# Altium schematic sheet EndStops.SchDoc: Endstops
size Letter; DocumentNumber: 6; SheetNumber: 6; SheetTotal: 11
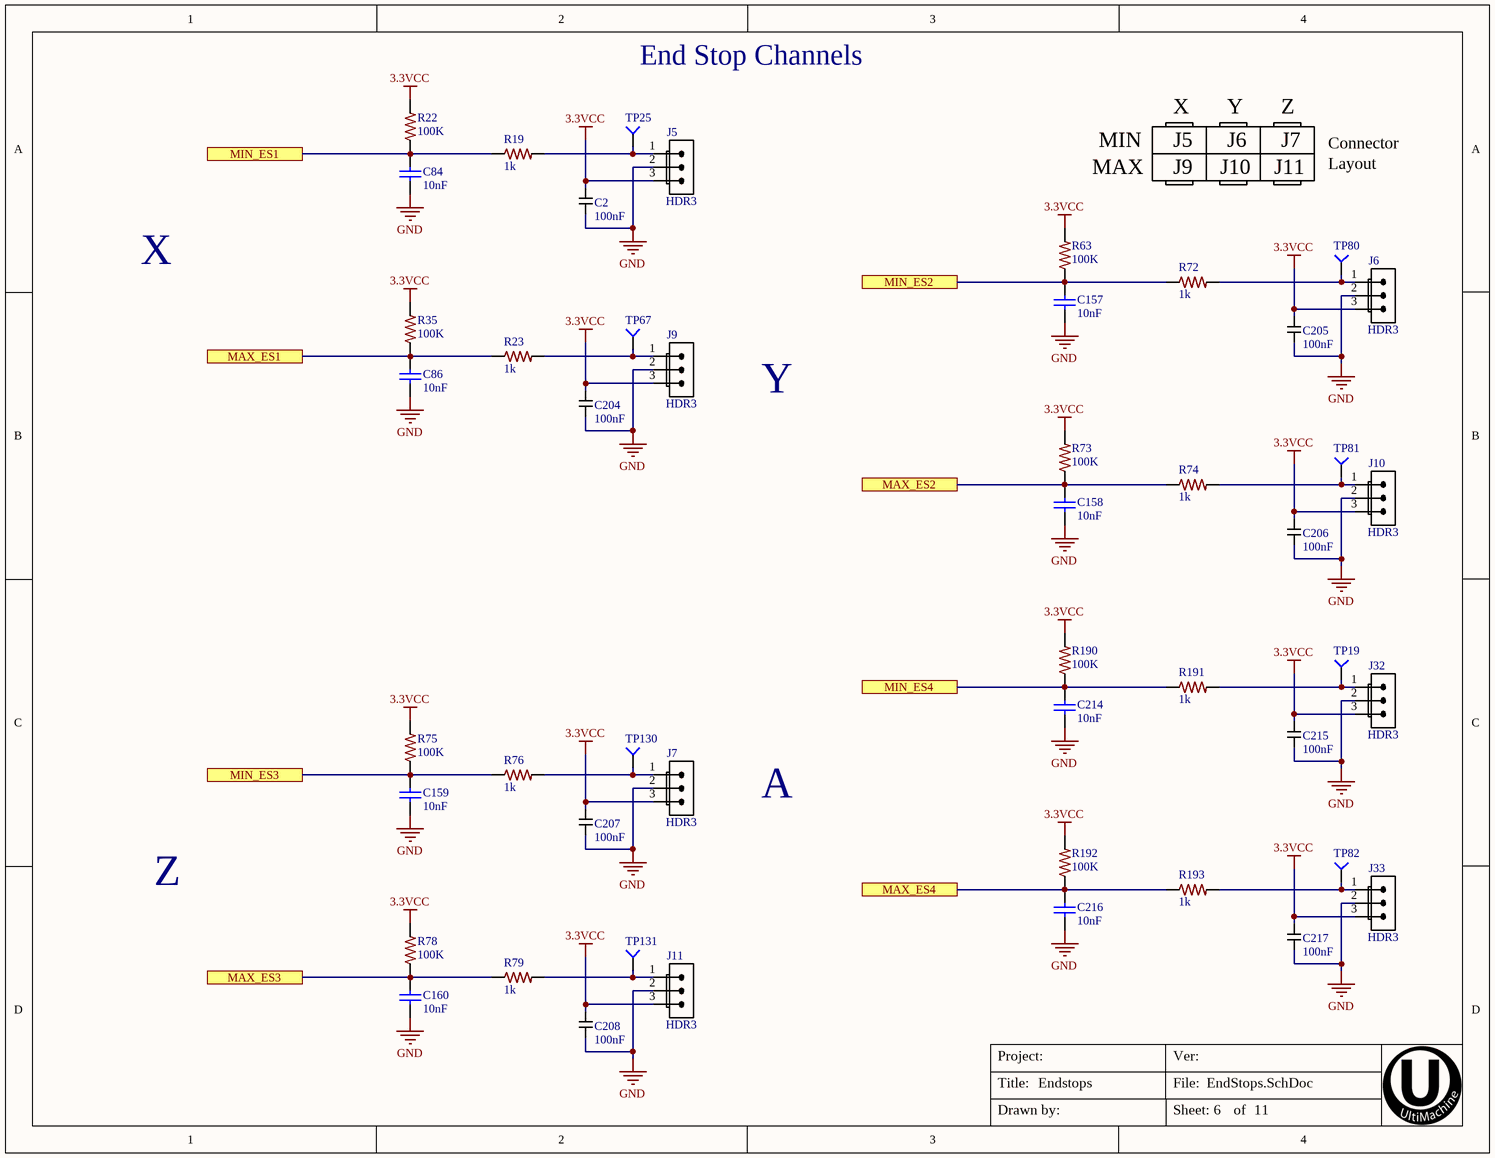
[diagram p0: EndStops.SchDoc]

## Parts
C2  100nF  [C0201 Large Pads]
C84  10nF  [C0402]
C86  10nF  [C0402]
C157  10nF  [C0402]
C158  10nF  [C0402]
C159  10nF  [C0402]
C160  10nF  [C0402]
C204  100nF  [C0201 Large Pads]
C205  100nF  [C0201 Large Pads]
C206  100nF  [C0201 Large Pads]
C207  100nF  [C0201 Large Pads]
C208  100nF  [C0201 Large Pads]
C214  10nF  [C0402]
C215  100nF  [C0201 Large Pads]
C216  10nF  [C0402]
C217  100nF  [C0201 Large Pads]
J5  value HDR3  [70543-02 PIN-IN-PASTE]  (hidden comment: Molex 70543-03)
J6  value HDR3  [70543-02 PIN-IN-PASTE]  (hidden comment: Molex 70543-03)
J7  value HDR3  [70543-02 PIN-IN-PASTE]  (hidden comment: Molex 70543-03)
J9  value HDR3  [70543-02 PIN-IN-PASTE]  (hidden comment: Molex 70543-03)
J10  value HDR3  [70543-02 PIN-IN-PASTE]  (hidden comment: Molex 70543-03)
J11  value HDR3  [70543-02 PIN-IN-PASTE]  (hidden comment: Molex 70543-03)
J32  value HDR3  [70543-02 PIN-IN-PASTE]  (hidden comment: Molex 70543-03)
J33  value HDR3  [70543-02 PIN-IN-PASTE]  (hidden comment: Molex 70543-03)
R19  1k  [R0402]
R22  100K  [R0402]
R23  1k  [R0402]
R35  100K  [R0402]
R63  100K  [R0402]
R72  1k  [R0402]
R73  100K  [R0402]
R74  1k  [R0402]
R75  100K  [R0402]
R76  1k  [R0402]
R78  100K  [R0402]
R79  1k  [R0402]
R190  100K  [R0402]
R191  1k  [R0402]
R192  100K  [R0402]
R193  1k  [R0402]
TP19  TP4  [TP-2]  (value not drawn)  (no BOM)
TP25  TP4  [TP-2]  (value not drawn)  (no BOM)
TP67  TP4  [TP-2]  (value not drawn)  (no BOM)
TP80  TP4  [TP-2]  (value not drawn)  (no BOM)
TP81  TP4  [TP-2]  (value not drawn)  (no BOM)
TP82  TP4  [TP-2]  (value not drawn)  (no BOM)
TP130  TP4  [TP-2]  (value not drawn)  (no BOM)
TP131  TP4  [TP-2]  (value not drawn)  (no BOM)

## Ports
MAX_ES1, MAX_ES2, MAX_ES3, MAX_ES4, MIN_ES1, MIN_ES2, MIN_ES3, MIN_ES4

## Nets
3.3VCC: C2.2 C204.2 C205.2 C206.2 C207.2 C208.2 C215.2 C217.2 J5.3(S) J6.3(S) J7.3(S) J9.3(S) J10.3(S) J11.3(S) J32.3(S) J33.3(S) R22.2 R35.2 R63.2 R73.2 R75.2 R78.2 R190.2 R192.2
GND: C2.1 C84.2 C86.2 C157.2 C158.2 C159.2 C160.2 C204.1 C205.1 C206.1 C207.1 C208.1 C214.2 C215.1 C216.2 C217.1 J5.2(S) J6.2(S) J7.2(S) J9.2(S) J10.2(S) J11.2(S) J32.2(S) J33.2(S)
MAX_ES1: C86.1 R23.1 R35.1 ; port MAX_ES1
MAX_ES2: C158.1 R73.1 R74.1 ; port MAX_ES2
MAX_ES3: C160.1 R78.1 R79.1 ; port MAX_ES3
MAX_ES4: C216.1 R192.1 R193.1 ; port MAX_ES4
MIN_ES1: C84.1 R19.1 R22.1 ; port MIN_ES1
MIN_ES2: C157.1 R63.1 R72.1 ; port MIN_ES2
MIN_ES3: C159.1 R75.1 R76.1 ; port MIN_ES3
MIN_ES4: C214.1 R190.1 R191.1 ; port MIN_ES4
NetJ5_1: J5.1(S) R19.2 TP25.1
NetJ6_1: J6.1(S) R72.2 TP80.1
NetJ7_1: J7.1(S) R76.2 TP130.1
NetJ9_1: J9.1(S) R23.2 TP67.1
NetJ10_1: J10.1(S) R74.2 TP81.1
NetJ11_1: J11.1(S) R79.2 TP131.1
NetJ32_1: J32.1(S) R191.2 TP19.1
NetJ33_1: J33.1(S) R193.2 TP82.1

## Notes on the sheet
- End Stop Channels
- MIN
- X
- J5
- Y
- J6
- Z
- J7
- Connector
- MAX
- J9
- J10
- J11
- Layout
- A
- Title:
- Project:
- File:
- Ver:
- Drawn by:
- Sheet:
- of

## Library data of the parts
C2 C204-C208 C215 C217 = 100nF 6.3V X5R 0201: CAP CER 0.1UF 6.3V 10% X5R 0201; PART: CL03A104KQ3NNNC; MANUFACTURER: Samsung; MANUFACTURER #: CL03A104KQ3NNNC; DISTRIBUTOR: DIGI-KEY; DISTRIBUTOR #: 1276-1013-1-ND; TOLERANCE: 10%; VOLTAGE: 6.3V
C84 C86 C157-C160 C214 C216 = GRM155R71H103JA88D: CAP CER 10nF 50V X7R 0402; PART DESCRIPTION: 10000pF ±5% 50V Ceramic Capacitor X7R 0402 (1005 Metric); MANUFACTURER: Murata; TOLERANCE: 5%; VALUE: 10nF; EE_SPEC: 50V; MANUFACTURER #: GRM155R71H103JA88D; DISTRIBUTOR #: 490-7763-1-ND; DISTRIBUTOR: Digi-Key Electronics; PART: GRM155R71H103JA88D
J5-J7 J9-J11 J32 J33 = CONN 3POS VERT 0.1" SHRD LOCKING PIP: 3 Positions Header, Shrouded Connector 0.100" (2.54mm) Through Hole Gold - Pin in Paste; MANUFACTURER #: 0705430002; TOLERANCE: -NA-; MANUFACTURER: Molex; DISTRIBUTOR #: WM4801-ND; DISTRIBUTOR: Digikey; PART: 0705430002; PART DESCRIPTION: 3 Positions Header, Shrouded Connector 0.100" (2.54mm) Through Hole Gold; EE_SPEC: -NA-
R19 R23 R72 R74 R76 R79 R191 R193 = RK73H1ETTP1001F: RES 0402 1k 63mW 1%; MANUFACTURER: Yageo; MANUFACTURER #: RC0402FR-071KL; PART DESCRIPTION: 1k Ohm ±1% 0.063W, 1/16W Chip Resistor 0402 (1005 Metric) Moisture Resistant Thick Film; EE_SPEC: 1/16W; VALUE: 1k; DISTRIBUTOR #: 311-1.00KLRTR-ND; DISTRIBUTOR: Digi-Key Electronics; PART: RC0402FR-071KL; TOLERANCE: 1%
R22 R35 R63 R73 R75 R78 R190 R192 = RC1005F104CS: RES SMD 100K OHM 1% 1/16W 0402; MANUFACTURER: Samsung; PART DESCRIPTION: 100k Ohm ±1% 0.063W, 1/16W Chip Resistor 0402 (1005 Metric) Moisture Resistant Thick Film; VALUE: 100K; MANUFACTURER #: RC1005F104CS; DISTRIBUTOR #: 1276-3432-1-ND; DISTRIBUTOR: Digi-Key Electronics; PART: RC1005F104CS; TOLERANCE: 1%; EE_SPEC: 1/16W
TP19 TP25 TP67 TP80-TP82 TP130 TP131 = Socket: MANUFACTURER #: NOTAPART-Testpoint; PART: NOTAPART-Testpoint